# Altium schematic sheet External Connectors.SchDoc
size A3; SheetNumber: 3; SheetTotal: 5
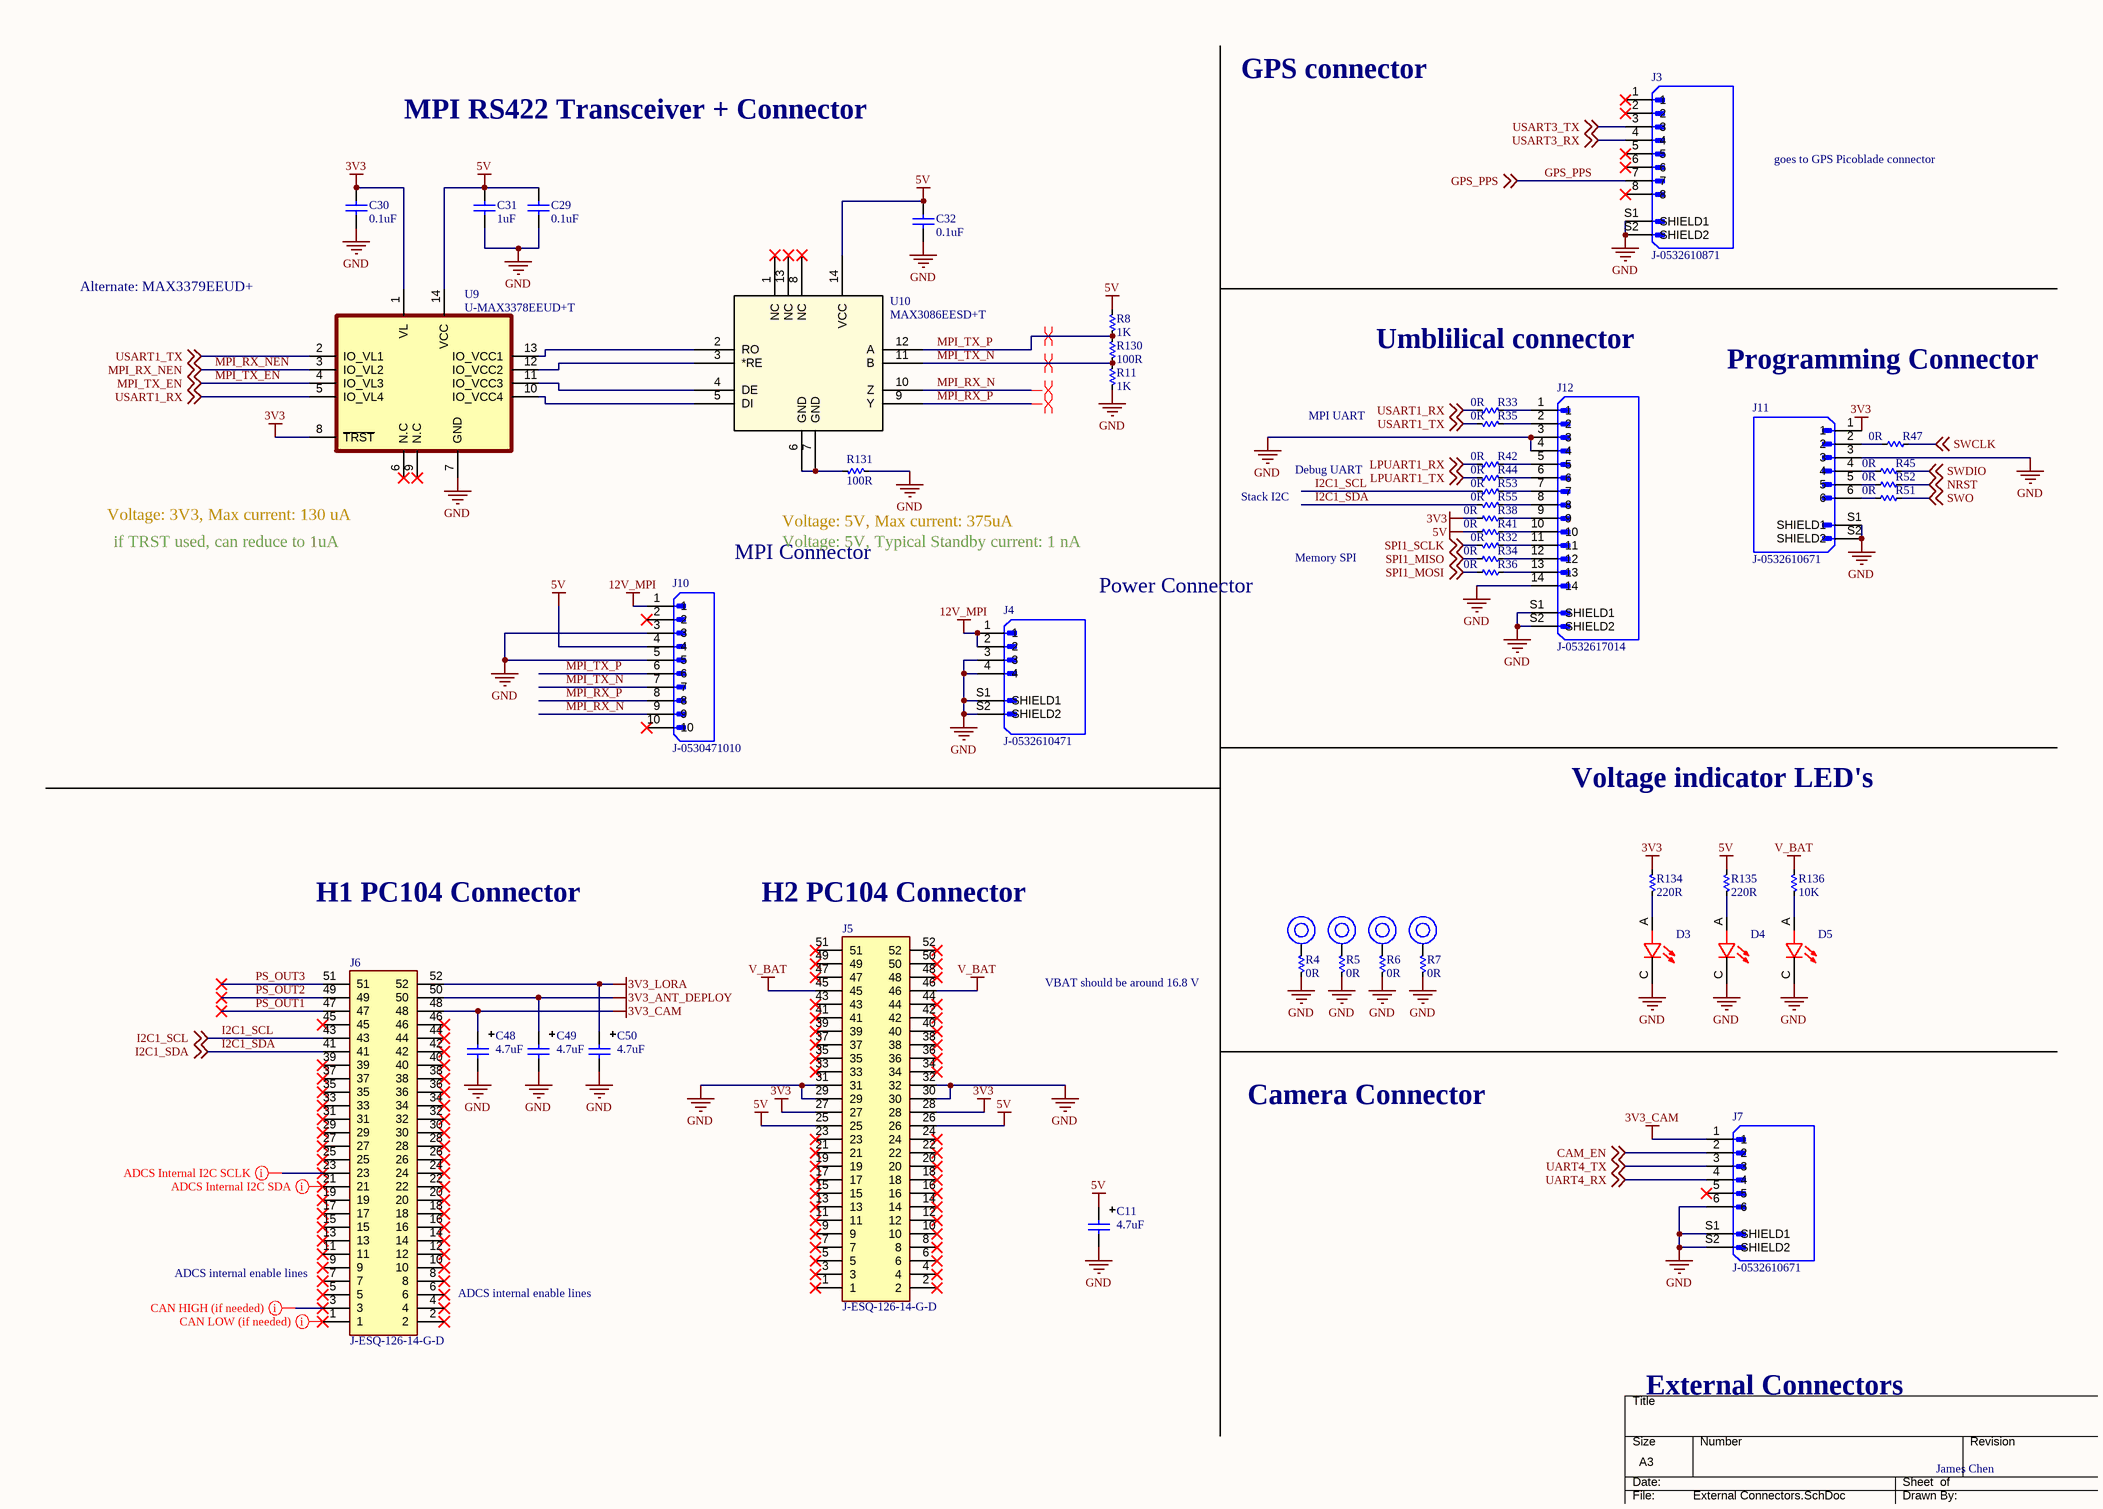
[diagram p0: External Connectors.SchDoc]

## Parts
*1  PC104 Mounting  [PC104 Mounting Points]  (value not drawn)
*2  PC104 Mounting  [PC104 Mounting Points]  (value not drawn)
*3  PC104 Mounting  [PC104 Mounting Points]  (value not drawn)
*4  PC104 Mounting  [PC104 Mounting Points]  (value not drawn)
C11  4.7uF  [CAP TANT 1206 (A) TCJ]
C29  0.1uF  [0603]
C30  0.1uF  [0603]
C31  1uF  [0603]
C32  0.1uF  [0603]
C48  4.7uF  [CAP TANT 1206 (A) TCJ]
C49  4.7uF  [CAP TANT 1206 (A) TCJ]
C50  4.7uF  [CAP TANT 1206 (A) TCJ]
D3  D-SML-D12U1WT86  [D-SML-D12U1WT86]  (value not drawn)
D4  D-SML-D12U1WT86  [D-SML-D12U1WT86]  (value not drawn)
D5  D-SML-D12U1WT86  [D-SML-D12U1WT86]  (value not drawn)
J3  J-0532610871  [J-532610871]
J4  J-0532610471  [J-53261-0471]
J5  J-ESQ-126-14-G-D  [J-ESQ-126-14-G-D]
J6  J-ESQ-126-14-G-D  [J-ESQ-126-14-G-D]
J7  J-0532610671  [J-0532610671]
J10  J-0530471010  [J-0530471010]
J11  J-0532610671  [J-0532610671]
J12  J-0532617014  [J-532617014]
R4  0R  [0603]
R5  0R  [0603]
R6  0R  [0603]
R7  0R  [0603]
R8  1K  [0603]
R11  1K  [0603]
R32  0R  [0603]
R33  0R  [0603]
R34  0R  [0603]
R35  0R  [0603]
R36  0R  [0603]
R38  0R  [0603]
R41  0R  [0603]
R42  0R  [0603]
R44  0R  [0603]
R45  0R  [0603]
R47  0R  [0603]
R51  0R  [0603]
R52  0R  [0603]
R53  0R  [0603]
R55  0R  [0603]
R130  100R  [0603]
R131  100R  [0603]
R134  value 220R  [0402]  (hidden comment: 100R)
R135  value 220R  [0402]  (hidden comment: 100R)
R136  10K  [0603]
U9  U-MAX3378EEUD+T  [U-MAX3378EEUD+T]
U10  MAX3086EESD+T  [U-MAX3086EESD+T]

## Nets
3V3: C30.1 J5.27 J5.28 J11.1 R38.2 R134.1 U9.1(VL) U9.8(~{TRST})
3V3_ANT_DEPLOY: C49.1 J6.50
3V3_CAM: C48.1 J6.48 J7.1
3V3_LORA: C50.1 J6.52
5V: C11.1 C29.1 C31.2 C32.1 J5.25 J5.26 J10.4 R8.2 R41.2 R135.1 U9.14(VCC) U10.14(VCC)
12V_MPI: J4.1 J4.2 J10.1
GND: C11.2 C29.2 C30.2 C31.1 C32.2 C48.2 C49.2 C50.2 D3.C D4.C D5.C J3.S1(SHIELD1) J3.S2(SHIELD2) J4.3 J4.4 J4.S1(SHIELD1) J4.S2(SHIELD2) J5.29 J5.30 J5.31 J5.32 J7.6 J7.S1(SHIELD1) J7.S2(SHIELD2) J10.3 J10.5 J11.3 J11.S1(SHIELD1) J11.S2(SHIELD2) J12.3 J12.4 J12.14 J12.S1(SHIELD1) J12.S2(SHIELD2) R4.1 R5.1 R6.1 R7.1 R11.1 R131.1 U9.7(GND)
V_BAT: J5.45 J5.46 R136.2
CAM_EN: J7.2 ; off-sheet CAM_EN
GPS_PPS: J3.7 ; off-sheet GPS_PPS
I2C1_SCL: J6.43 R53.1 ; off-sheet I2C1_SCL
I2C1_SDA: J6.41 R55.1 ; off-sheet I2C1_SDA
LPUART1_RX: R42.1 ; off-sheet LPUART1_RX
LPUART1_TX: R44.1 ; off-sheet LPUART1_TX
MPI_RX_N: J10.9 U10.10(Z)
MPI_RX_NEN: U9.3(IO_VL2) ; off-sheet MPI_RX_NEN
MPI_RX_P: J10.8 U10.9(Y)
MPI_TX_EN: U9.4(IO_VL3) ; off-sheet MPI_TX_EN
MPI_TX_N: J10.7 R11.2 R130.1 U10.11(B)
MPI_TX_P: J10.6 R8.1 R130.2 U10.12(A)
NRST: R52.1 ; off-sheet NRST
PS_OUT1: J6.47
PS_OUT2: J6.49
PS_OUT3: J6.51
SPI1_MISO: R34.2 ; off-sheet SPI1_MISO
SPI1_MOSI: R36.2 ; off-sheet SPI1_MOSI
SPI1_SCLK: R32.1 ; off-sheet SPI1_SCLK
SWCLK: R47.1 ; off-sheet SWCLK
SWDIO: R45.1 ; off-sheet SWDIO
SWO: R51.1 ; off-sheet SWO
UART4_RX: J7.4 ; off-sheet UART4_RX
UART4_TX: J7.3 ; off-sheet UART4_TX
USART1_RX: R33.1 U9.5(IO_VL4) ; off-sheet USART1_RX
USART1_TX: R35.1 U9.2(IO_VL1) ; off-sheet USART1_TX
USART3_RX: J3.4 ; off-sheet USART3_RX
USART3_TX: J3.3 ; off-sheet USART3_TX
Net*1_1: *1.1 R4.2
Net*2_1: *2.1 R5.2
Net*3_1: *3.1 R6.2
Net*4_1: *4.1 R7.2
NetD3_A: D3.A R134.2
NetD4_A: D4.A R135.2
NetD5_A: D5.A R136.1
NetJ11_2: J11.2 R47.2
NetJ11_4: J11.4 R45.2
NetJ11_5: J11.5 R52.2
NetJ11_6: J11.6 R51.2
NetJ12_1: J12.1 R33.2
NetJ12_2: J12.2 R35.2
NetJ12_5: J12.5 R42.2
NetJ12_6: J12.6 R44.2
NetJ12_7: J12.7 R53.2
NetJ12_8: J12.8 R55.2
NetJ12_9: J12.9 R38.1
NetJ12_10: J12.10 R41.1
NetJ12_11: J12.11 R32.2
NetJ12_12: J12.12 R34.1
NetJ12_13: J12.13 R36.1
NetR131_2: R131.2 U10.6(GND) U10.7(GND)
NetU9_10: U9.10(IO_VCC4) U10.5(DI)
NetU9_11: U9.11(IO_VCC3) U10.4(DE)
NetU9_12: U9.12(IO_VCC2) U10.3(*RE)
NetU9_13: U9.13(IO_VCC1) U10.2(RO)

Not connected (* = marked no-connect by the designer): J3 1* 2* 5* 6* 8*; J5 1* 2* 3* 4* 5* 6* 7* 8* 9* 10* 11* 12* 13* 14* 15* 16* 17* 18* 19* 20* 21* 22* 23* 24* 33* 34* 35* 36* 37* 38* 39* 40* 41* 42* 43* 44* 47* 48* 49* 50* 51* 52*; J6 1* 2* 3* 4* 5* 6* 7* 8* 9* 10* 11* 12* 13* 14* 15* 16* 17* 18* 19* 20* 21* 22* 23* 24* 25* 26* 27* 28* 29* 30* 31* 32* 33* 34* 35* 36* 37* 38* 39* 40* 42* 44* 45* 46*; J7 5*; J10 2* 10*; U9 6(N.C)* 9(N.C)*; U10 1(NC)* 8(NC)* 13(NC)*

## Layout directives
mark named CAN LOW (if needed): NetJ6_1
mark named CAN HIGH (if needed): NetJ6_3
mark named ADCS Internal I2C SDA: NetJ6_21
mark named ADCS Internal I2C SCLK: NetJ6_23
differential pair; net class DIF 100 OHMS: MPI_RX_N, MPI_RX_P, MPI_TX_N, MPI_TX_P

## Notes on the sheet
- GPS connector
- MPI RS422 Transceiver + Connector
- goes to GPS Picoblade connector
- Alternate: MAX3379EEUD+
- Umblilical connector
- Programming Connector
- MPI UART
- Stack I2C
- Debug UART
- Voltage: 3V3, Max current: 130 uA
- if TRST used, can reduce to 1uA
- (near J10) MPI Connector
- (near R131) Voltage: 5V, Max current: 375uA
- Voltage: 5V, Typical Standby current: 1 nA
- Memory SPI
- (near J4) Power Connector
- Voltage indicator LED's
- H1 PC104 Connector
- (near J5) H2 PC104 Connector
- VBAT should be around 16.8 V
- Camera Connector
- (near J6) ADCS internal enable lines
- External Connectors
- James Chen
- THIS DOCUMENT AND THE DATA DISCLOSED HEREIN OR
- HEREWITH IS THE PROPERTY OF ALTIUM LIMITED AND MAY
- DWG NO:
- REVISION
- REV:
- DESCRIPTION
- DATE
- APPROVED
- BE FREELY DISTRIBUTED IN WHOLE. NO RIGHTS ARE
- RESERVED OR EXPRESS OR IMPLIED WARANTEE GIVEN.
- ENG:
- APPROVALS
- PROJECT
- DSN:
- CHK:
- REFERENCE DOCUMENTS
- PROJECT REVISION:
- TITLE
- DOCUMENT REVISION:
- DESIGN ITEM:
- BOM:
- FAB DWG:
- PCB DWG:
- ASSY DWG:
- SCALE:
- A3
- SIZE
- CAGE CODE
- FILE NAME
- DWG NO.
- SHEET
- OF
- REV

## Library data of the parts
C11 C48-C50 = CT-474-M-20V-OTH-1206: 4.7 µF Molded Tantalum Capacitors 20 V 1206 (3216 Metric) 4Ohm; Manufacturer: AVX Corporation; Manufacturer Part #: TAJA475K020RNJ; ComponentLink1Description: Datasheet; ComponentLink1URL: *; ComponentLink2Description: Manufacturer Website; ComponentLink2URL: *; Distributor: Digikey; Distributor Part #: 478-1668-1-ND; Part Description: 4.7 µF Molded Tantalum Capacitors 20 V 1206 (3216 Metric) 4Ohm; Value: 4.7uF
C29 C30 C32 = CC-104-K-25V-X7R-0603: 0.1 µF ±10% 25V Ceramic Capacitor X7R 0603 (1608 Metric); Manufacturer: Samsung Electro-Mechanics; Manufacturer Part #: CL10B104KA8NNNC; ComponentLink1description: Datasheet; ComponentLink1URL: https://ds.yuden.co.jp/TYCOMPAS/ut/detail?pn=TMK105BJ104KV-F%20%20&u=M; ComponentLink2description: Manufacturer Website; Distributor: Digikey; Distributor Part #: 1276-1006-1-ND; Part Description: 0.1 µF ±10% 25V Ceramic Capacitor X7R 0603 (1608 Metric); ComponentLink2URL: https://www.yuden.co.jp/or/; Value: 0.1uF
C31 = CC-105-K-25V-X7R-0603: CAP CER 1UF 25V X7R 0603; Manufacturer: Yageo; Manufacturer Part #: CC0603KRX7R8BB105; ComponentLink1Description: Datasheet; ComponentLink1URL: https://www.yageo.com/upload/media/product/productsearch/datasheet/mlcc/UPY-GPHC_X7R_6.3V-to-50V_18.pdf; ComponentLink2Description: Manufacture Website; ComponentLink2URL: https://www.yageo.com/en/Home; Distributor: Digikey; Distributor Part #: 311-1802-1-ND; Part Description: CAP CER 1UF 25V X7R 0603; SignalCraft Part #: CC-105-K-25V-X7R-0603; Value: 1uF
D3-D5 = D-SML-D12U1WT86: Red 620nm LED Indication - Discrete 2.2V 0603 _1608 Metric; Manufacturer: Rohm Semiconductor; Manufacturer Part #: SML-D12U1WT86; Distributor: Digikey; Distributor Part #: SML-D12U1WT86CT-ND
J3 = J-0532610871: CONN HEADER SMD R/A 8POS 1.25MM; Manfacturer: Molex; Manfacturer Part #: 0532610871; Distributor Part #: WM7626CT-ND; Distributor: Digi-Key
J4 = J-0532610471: CONN HEADER SMD R/A 4POS 1.25MM; Manfacturer: Molex; Manfacturer Part #: 0532610471; Distributor Part #: WM7622CT-ND; Distributor: Digi-Key
J5 J6 = J-ESQ-126-14-G-D: CONN SOCKET 52POS 0.1 GOLD PCB; Manufacturer: Samtec Inc.; Manufacturer Part #: ESQ-126-14-G-D; Distributor: Digikey; Distributor Part #: SAM11114-ND
J7 J11 = J-0532610671: CONN HEADER SMD R/A 6POS 1.25MM; Manfacturer: Molex; Distributor: Digi-Key; Manfacturer Part #: 0532610671; Distributor Part #: WM7624CT-ND
J10 = J-0530471010: CONN HEADER VERT 10POS 1.25MM; Manufacturer: Molex; Manufacturer Part #: 0530471010; Distributor: Digikey; Distributor Part #: WM1739-ND
J12 = J-0532617014: Connector Header Surface Mount, Right Angle 14 position 0.049 (1.25mm); Manufacturer: Molex; Manufacturer Part #: 0532617014; Distributor: Digikey; Distributor Part #: 900-0532617014CT-ND; SnapEDA_Link: https://www.snapeda.com/parts/532617014/Molex/view-part/5064407/?ref=snap
R4-R7 R32-R36 R38 R41 R42 R44 R45 R47 R51-R53 R55 = RT-0R00-F-1/10W-0603: 0 Ohms Jumper 0.1W, 1/10W Chip Resistor 0603 (1608 Metric) Automotive AEC-Q200 Thick Film; Manufacturer: Stackpole Electronics Inc; Manufacturer Part #: RMCF0603ZT0R00; ComponentLink1description: Datasheet; ComponentLink1URL: https://industrial.panasonic.com/ww/products/resistors/chip-resistors/general-purpose-chip-resistors/models/ERJ2GE0R00X; ComponentLink2description: Manufacturer Website; Distributor: Digikey; Distributor Part #: RMCF0603ZT0R00CT-ND; Part Description: 0 Ohms Jumper 0.1W, 1/10W Chip Resistor 0603 (1608 Metric) Automotive AEC-Q200 Thick Film; ComponentLink2URL: https://industrial.panasonic.com/ww/products/resistors/chip-resistors/general-purpose-chip-resistors/models/ERJ2GE0R00X; Value: 0R
R8 R11 = RT-1K0-F-1/16W-0603: RES SMD 1K OHM 1% 1/16W 0603; Manufacturer: TE Connectivity Passive Product; Manufacturer Part #: CPF0603F1K0C1; ComponentLink1description: Datasheet; ComponentLink1URL: https://www.vishay.com/docs/20035/dcrcwe3.pdf; ComponentLink2description: Manufacturer Website; Distributor: Digikey; Distributor Part #: A102226CT-ND; Part Description: RES SMD 1K OHM 1% 1/16W 0603; ComponentLink2URL: https://www.vishay.com/; Value: 1K
R130 R131 = RT-100R-F-1/16W-0603: RES SMD 100 OHM 0.5% 1/16W 0603; Manufacturer: Susumu; Manufacturer Part #: RR08P100DCT-ND; Distributor: Digikey; Distributor Part #: RR08P100DCT-ND; Part Description: RES SMD 100 OHM 0.5% 1/16W 0603; Value: 100R
R134 R135 = RT-220R-F-1/16W-0402: RES 220 OHM 5% 1/16W 0402; Manufacturer: Yageo; Manufacturer Part #: RC0402JR-07220RL; Distributor: Digikey; Distributor Part #: 311-220JRCT-ND; Part Description: RES 220 OHM 5% 1/16W 0402
R136 = RT-10K0-F-1/16W-0603: 10 kOhms ±0.1% 0.063W, 1/16W Chip Resistor 0603 (1608 Metric) - Thin Film; Manufacturer: TE Connectivity Passive Product; Manufacturer Part #: CPF0603B10KE; ComponentLink1description: Datasheet; ComponentLink1URL: https://www.vishay.com/docs/20035/dcrcwe3.pdf; ComponentLink2description: Manufacturer Website; Distributor: Digikey; Distributor Part #: A119886CT-ND; Part Description: 10 kOhms ±0.1% 0.063W, 1/16W Chip Resistor 0603 (1608 Metric) - Thin Film; ComponentLink2URL: https://www.vishay.com/; Value: 10K
U9 = U-MAX3378EEUD+T: IC TRNSLTR BIDIRECTIONAL 14TSSOP; Manufacturer: Maxim Integrated; Manufacturer Part #: MAX3378EEUD+T; Distributor: Digikey; Distributor Part #: MAX3378EEUD+TCT-ND
U10 = U-MAX3086EESD+T: IC TRANSCEIVER FULL 1/1 14SOIC; Manufacturer: Maxim Integrated Products; Manufacturer Part #: MAX3086EESD+T; Distributor: Digikey; Distributor Part #: MAX3086EESD+TCT-ND; Type: DEV